# Altium schematic sheet obc_flash.SchDoc: Flash Memory
size A4; DrawnBy: Mohamed Hirole; Organization: UTAT SS; DocumentNumber: 2; Revision: 2.0; SheetNumber: 2; SheetTotal: 8
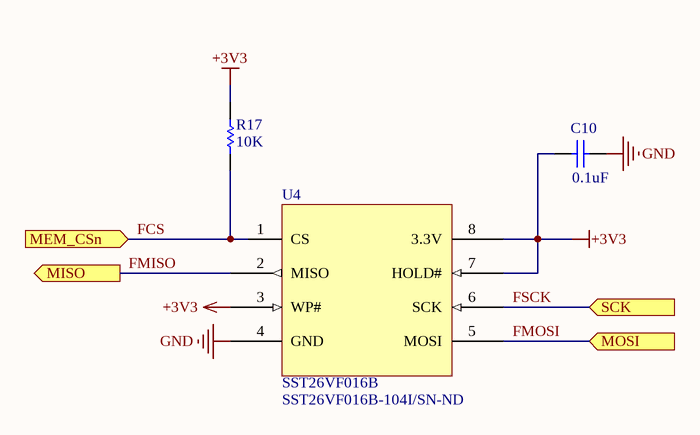
[diagram p0: obc_flash.SchDoc]

## Parts
C10  value 0.1uF  [CAP0603R]  (hidden comment: 0603)
R17  value 10K  [RES0603R]  (hidden comment: 0603)
U4  SST26VF016B  Supplier Part Number 1: SST26VF016B-104I/SN-ND  [SOIC127P500X600-8N]

## Ports
MEM_CSn (in), MISO (out), MOSI (in), SCK (in)

## Nets
+3V3: C10.1 R17.2 U4.3(WP#) U4.7(HOLD#) U4.8(3.3V)
GND: C10.2 U4.4(GND)
FCS: R17.1 U4.1(CS) ; port MEM_CSn
FMISO: U4.2(MISO) ; port MISO
FMOSI: U4.5(MOSI) ; port MOSI
FSCK: U4.6(SCK) ; port SCK

## Library data of the parts
C10 = CAP0603: 0603 capacitor
R17 = RES0603: 0603 resistor
U4 = SST26VF016B: 2.5V/3.0V 16 Mbit Serial Quad I/O (SQI) Flash Memory; ComponentLink1Description: SST25VF016B; ComponentLink1URL: https://www.digikey.ca/product-detail/en/microchip-technology/SST26VF016B-104I-SN/SST26VF016B-104I-SN-ND/5033651; Supplier 1: Digi-Key